# Altium schematic sheet Connector.SchDoc
size A4; SheetNumber: 3; SheetTotal: 3
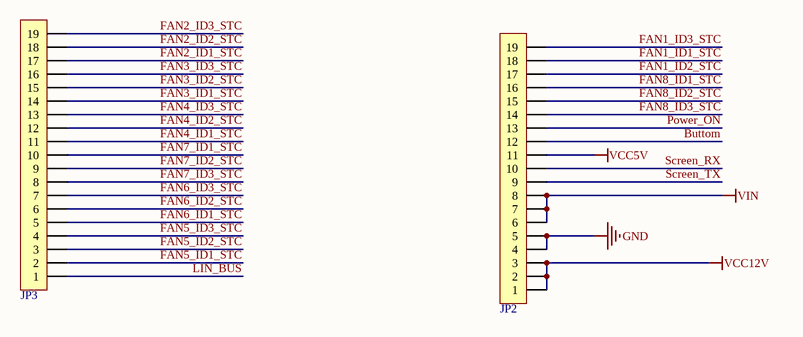
[diagram p0: Connector.SchDoc]

## Parts
JP2  HDR-1X19  [贴片排母2.54mm_交错_19P]  (value not drawn)
JP3  HDR-1X19  [贴片排母2.54mm_交错_19P]  (value not drawn)

## Nets
GND: JP2.4 JP2.5
VCC5V: JP2.11
VCC12V: JP2.1 JP2.2 JP2.3
VIN: JP2.6 JP2.7 JP2.8
Buttom: JP2.12
FAN1_ID1_STC: JP2.18
FAN1_ID2_STC: JP2.17
FAN1_ID3_STC: JP2.19
FAN2_ID1_STC: JP3.17
FAN2_ID2_STC: JP3.18
FAN2_ID3_STC: JP3.19
FAN3_ID1_STC: JP3.14
FAN3_ID2_STC: JP3.15
FAN3_ID3_STC: JP3.16
FAN4_ID1_STC: JP3.11
FAN4_ID2_STC: JP3.12
FAN4_ID3_STC: JP3.13
FAN5_ID1_STC: JP3.2
FAN5_ID2_STC: JP3.3
FAN5_ID3_STC: JP3.4
FAN6_ID1_STC: JP3.5
FAN6_ID2_STC: JP3.6
FAN6_ID3_STC: JP3.7
FAN7_ID1_STC: JP3.10
FAN7_ID2_STC: JP3.9
FAN7_ID3_STC: JP3.8
FAN8_ID1_STC: JP2.16
FAN8_ID2_STC: JP2.15
FAN8_ID3_STC: JP2.14
LIN_BUS: JP3.1
Power_ON: JP2.13
Screen_RX: JP2.10
Screen_TX: JP2.9

## Library data of the parts
JP2 JP3 = Header 19: 19P接插件; 版权归属: 源创客; BOM名称: 19P接插件; 学习资源: www.ooocke.com